# Altium schematic sheet VGA-SCH.SchDoc
size A4; SheetNumber: 1; SheetTotal: 1
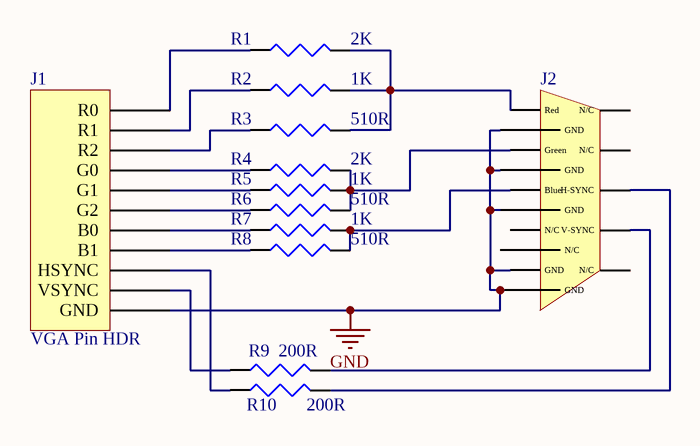
[diagram p0: VGA-SCH.SchDoc]

## Parts
J1  VGA Pin HDR  [VGA HDR]
J2  Female DB15 VGA connector  [VGA CONNECTOR]  (value not drawn)
R1  2K  [Resistor 1206]
R2  1K  [Resistor 1206]
R3  510R  [Resistor 1206]
R4  2K  [Resistor 1206]
R5  1K  [Resistor 1206]
R6  510R  [Resistor 1206]
R7  1K  [Resistor 1206]
R8  510R  [Resistor 1206]
R9  200R  [Resistor 1206]
R10  200R  [Resistor 1206]

## Nets
GND: J1.11(GND) J2.5(GND) J2.6(GND) J2.7(GND) J2.8(GND) J2.10(GND)
NetJ1_1: J1.1(R0) R1.1
NetJ1_2: J1.2(R1) R2.1
NetJ1_3: J1.3(R2) R3.1
NetJ1_4: J1.4(G0) R4.1
NetJ1_5: J1.5(G1) R5.1
NetJ1_6: J1.6(G2) R6.1
NetJ1_7: J1.7(B0) R7.1
NetJ1_8: J1.8(B1) R8.1
NetJ1_9: J1.9(HSYNC) R10.1
NetJ1_10: J1.10(VSYNC) R9.1
NetJ2_1: J2.1(Red) R1.2 R2.2 R3.2
NetJ2_2: J2.2(Green) R4.2 R5.2 R6.2
NetJ2_3: J2.3(Blue) R7.2 R8.2
NetJ2_13: J2.13(H-SYNC) R10.2
NetJ2_14: J2.14(V-SYNC) R9.2

Not connected (* = marked no-connect by the designer): J2 4(N/C) 9(N/C) 11(N/C) 12(N/C) 15(N/C)

## Library data of the parts
J1 = Connector: VGA HDR: VGA pin male header
J2 = Connector: DB15 VGA
R1 R4 = Resistor: 2K R: Res Thick Film 1206 2K Ohm 1% 1/4W ±100ppm/°C Molded SMD SMD Paper T/R; Manufacturer: Yageo; Manufacturer Part Number: RC1206FR-132KL; Resistance: 2kR; Voltage Rating: 200V; Power Rating: 250mW; Supplier 1: Digi-Key; RoHS: Yes; Category: Chip SMD Resistors; Pricing 1: 20000=0,00667 (USD); Case/Package: 1206; Case Code (Imperial): 1206; Case Code (Metric): 3216; Contact Plating: Tin,Matte; Size Code: 1206; Min Operating Temperature: -55°C; Max Operating Temperature: 155°C; Tolerance: 1%; Packaging: Tape and Reel; Resistor Type: Thick Film; Temperature Coefficient: 100ppm/°C; Termination: SMD/SMT; Series: RC; Package Quantity: 5000; Length: 3.1mm; Width: 1.6mm; Height: 0.55mm; Radiation Hardening: No; Lead Free: Lead Free; RoHS Compliant: Yes; ComponentLink1URL: https://datasheet.ciiva.com/16834/pyu-rc1206-51-rohs-l-4-16834793.pdf?src-supplier=Future+Electronics; ComponentLink1Description: https://datasheet.ciiva.com/16834/pyu-rc1206-51-rohs-l-4-16834793.pdf?src-supplier=Future+Electronics; Supplier Part Number 1: 13-RC1206FR-132KL-ND
R2 R5 R7 = Resistor: 1K R: Res Thick Film 1206 1K Ohm 5% 1/4W ±100ppm/°C Molded SMD SMD Paper T/R; Manufacturer: Yageo; Manufacturer Part Number: RC1206JR-131KL; Resistance: 1kR; Power Rating: 250mW; Voltage Rating: 200V; Supplier 1: Mouser; RoHS: Yes; Category: Chip SMD Resistors; Stock 1: 38950; Pricing 1: 1=0,20000, 10=0,06700, 50=0,06700, 100=0,02800, 1000=0,01300, 10000=0,00800 (USD); Case/Package: 1206; Case Code (Imperial): 1206; Case Code (Metric): 3216; Size Code: 1206; Contact Plating: Tin,Matte; Min Operating Temperature: -55°C; Max Operating Temperature: 155°C; Tolerance: 5%; Packaging: Tape and Reel; Temperature Coefficient: 100ppm/°C; Series: RC; Resistor Type: Thick Film; Termination: SMD/SMT; Construction: Rectangular; Length: 3.1mm; Depth: 1.6mm; Radiation Hardening: No; RoHS Compliant: Yes; Lead Free: Lead Free; Military Standard: Not; ComponentLink1URL: http://www.mouser.com/ds/2/447/PYu-RC1206_51_RoHS_L-4-349080.pdf?src-supplier=Mouser; ComponentLink1Description: http://www.mouser.com/ds/2/447/PYu-RC1206_51_RoHS_L-4-349080.pdf?src-supplier=Mouser; ComponentLink2URL: http://www.yageo.com/documents/recent/PYu-RC1206_51_RoHS_L-4.pdf?src-supplier=Future+Electronics; ComponentLink2Description: http://www.yageo.com/documents/recent/PYu-RC1206_51_RoHS_L-4.pdf?src-supplier=Future+Electronics; ComponentLink3URL: http://www.yageo.com/documents/recent/PYu-RC1206_51_RoHS_L_v5.pdf?src-supplier=Avnet; ComponentLink3Description: http://www.yageo.com/documents/recent/PYu-RC1206_51_RoHS_L_v5.pdf?src-supplier=Avnet; Supplier Part Number 1: 603-RC1206JR-131KL
R3 R6 R8 = Resistor: 510R: Res Thick Film 1206 510 Ohm 1% 1/4W ±100ppm/°C Molded SMD SMD Paper T/R; Manufacturer: Vishay Dale; Manufacturer Part Number: CRCW1206510RFKEB; Power Rating: 250mW; Voltage Rating: 200V; Supplier 1: Digi-Key; RoHS: Yes; Category: Chip SMD Resistors; Pricing 1: 20000=0,00965 (USD); Case/Package: 1206; Case Code (Imperial): 1206; Case Code (Metric): 3216; Contact Plating: Tin; Weight: 0.000353oz; Min Operating Temperature: -55°C; Max Operating Temperature: 155°C; Resistance: 510R; Tolerance: 1%; Temperature Coefficient: 100ppm/°C; Packaging: Tape and Reel; Resistor Type: Thick Film; Series: CRCW; Number of Terminations: 2; Max Power Dissipation: 250mW; Package Quantity: 10000; Termination: SMD/SMT; Features: Automotive AEC-Q200; Length: 0.126inch; Width: 0.063inch; Height: 0.024inch; Radiation Hardening: No; RoHS Compliant: Yes; Lead Free: Lead Free; ComponentLink1URL: https://datasheet.ciiva.com/8931/dcrcwe3-8931628.pdf?src-supplier=Avnet; ComponentLink1Description: https://datasheet.ciiva.com/8931/dcrcwe3-8931628.pdf?src-supplier=Avnet; ComponentLink2URL: https://datasheet.ciiva.com/5583/dcrcwe3-109170-5583982.pdf?src-supplier=Mouser; ComponentLink2Description: https://datasheet.ciiva.com/5583/dcrcwe3-109170-5583982.pdf?src-supplier=Mouser; Supplier Part Number 1: CRCW1206510RFKEB-ND
R9 R10 = Resistor: 200R: Surface Mount Thick Film Resistor, AEC-Q200 ERJ Series, 200 ohm, 250 mW, - 1%, 200 V; Manufacturer: Panasonic; Manufacturer Part Number: ERJ-U08F2000V; Temperature Coefficient: 100ppm/°C; Power Rating: 250mW; Voltage Rating: 200V; Current Rating: 2A; Supplier 1: Rs; RoHS: Yes; Category: Chip SMD Resistors; Stock 1: 6900; Pricing 1: 4000=0,04900 (EUR); Case/Package: 1206; Case Code (Imperial): 1206; Case Code (Metric): 3216; Weight: 0.000571oz; Min Operating Temperature: -55°C; Max Operating Temperature: 155°C; Packaging: Tape and Reel; Resistance: 200R; Tolerance: 1%; Resistor Type: Thick Film; Series: ERJ-U08; Termination: SMD/SMT; Package Quantity: 5000; Voltage Rating (DC): 200V; Resistance Tolerance: 1%; Technology: THICK FILM; Length: 3.2mm; Width: 1.6mm; Height: 0.6mm; Depth: 1.6mm; RoHS Compliant: Yes; Reach SVHC Compliant: Yes; ComponentLink1URL: https://datasheet.ciiva.com/7891/1638979-7891542.pdf?src-supplier=Element14; ComponentLink1Description: https://datasheet.ciiva.com/7891/1638979-7891542.pdf?src-supplier=Element14; ComponentLink2URL: https://datasheet.ciiva.com/24195/ras-erj-u-267552-24195551.pdf?src-supplier=Mouser; ComponentLink2Description: https://datasheet.ciiva.com/24195/ras-erj-u-267552-24195551.pdf?src-supplier=Mouser; Supplier Part Number 1: 1723988